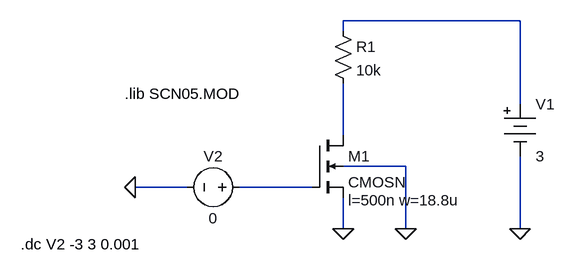
[diagram p0: schematic ex6_cs.asc]
ex6_cs.asc, the LTspice schematic file:
Version 4
SHEET 1 932 680
WIRE 432 0 160 0
WIRE 160 16 160 0
WIRE 432 128 432 0
WIRE 160 176 160 96
WIRE 256 224 160 224
WIRE -80 256 -160 256
WIRE 112 256 0 256
WIRE 160 320 160 272
WIRE 256 320 256 224
WIRE 432 320 432 208
FLAG 160 320 0
FLAG 256 320 0
FLAG 432 320 0
FLAG -160 256 0
SYMBOL nmos4 112 176 R0
WINDOW 123 56 100 Left 2
SYMATTR Value2 l=500n w=18.8u
SYMATTR InstName M1
SYMATTR Value CMOSN
SYMBOL res 144 0 R0
SYMATTR InstName R1
SYMATTR Value 10k
SYMBOL Misc\\battery 432 112 R0
SYMATTR InstName V1
SYMATTR Value 3
SYMBOL voltage 16 256 R90
WINDOW 0 -32 56 VBottom 2
WINDOW 3 32 56 VTop 2
SYMATTR InstName V2
SYMATTR Value 0
TEXT -176 112 Left 2 !.lib SCN05.MOD
TEXT -336 344 Left 2 !.dc V2 -3 3 0.001

The netlist it stands for:
* ex6_cs.asc
M1 N002 N003 0 0 CMOSN l=500n w=18.8u
R1 N001 N002 10k
V1 N001 0 3
V2 N003 0 0
.model NMOS NMOS
.model PMOS PMOS
.lib standard.mos
.lib SCN05.MOD
.dc V2 -3 3 0.001
.backanno
.end